# EAGLE design Teensy3_2_rev2 (EAGLE 9.5.1)

## Sheet 1 of 2: IO Conditioning
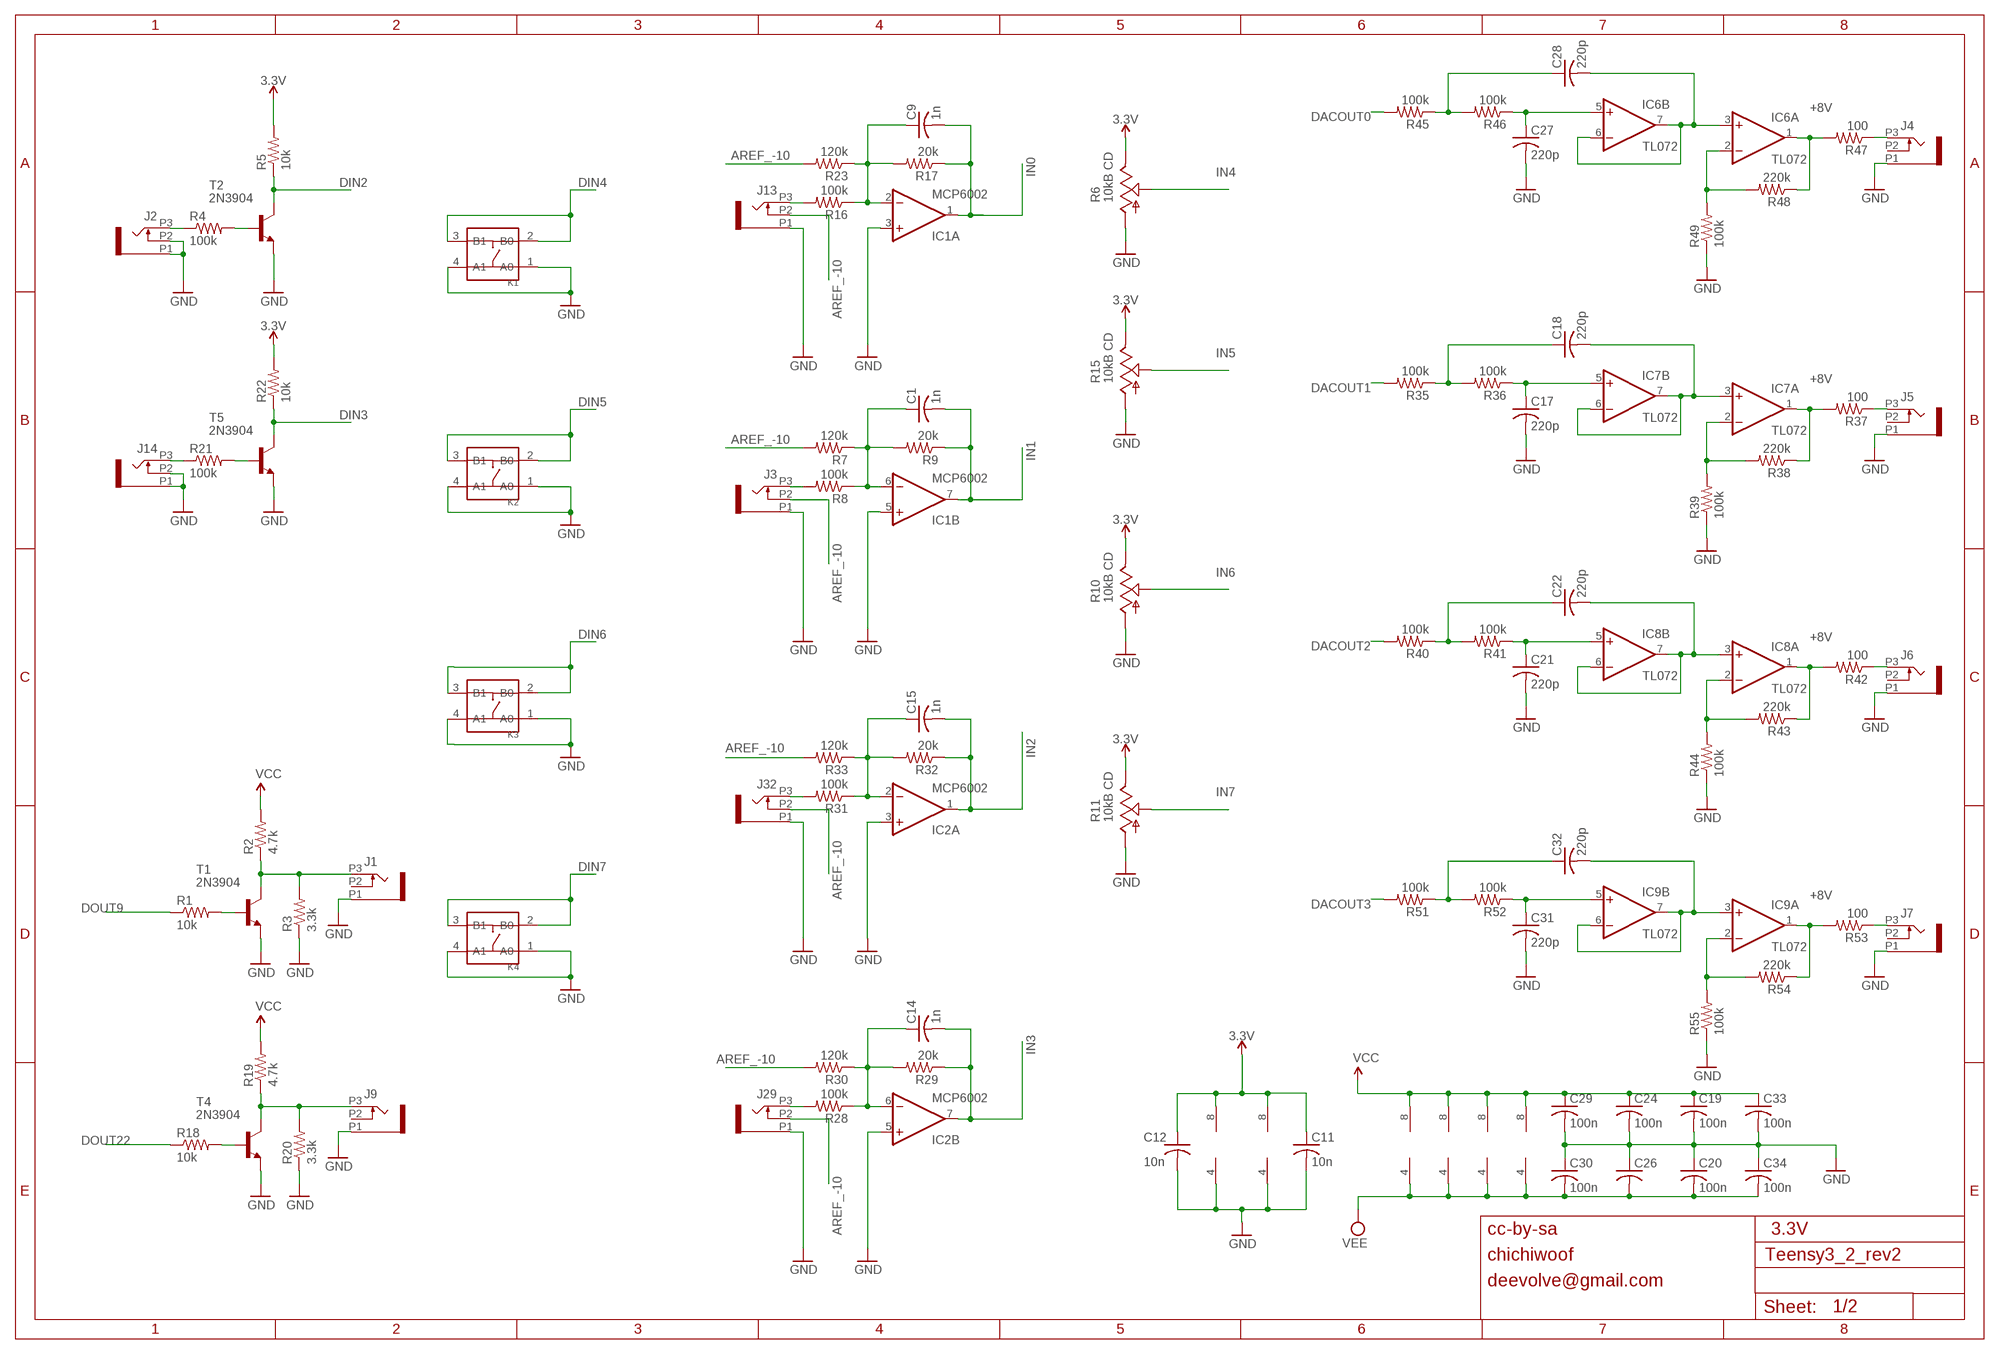
[diagram p0: schematic, sheet 1]

### Parts
C1  1n  C-US050-025X075  [C050-025X075]
C9  1n  C-US050-025X075  [C050-025X075]
C11  10n  C-US050-025X075  [C050-025X075]
C12  10n  C-US050-025X075  [C050-025X075]
C14  1n  C-US050-025X075  [C050-025X075]
C15  1n  C-US050-025X075  [C050-025X075]
C17  220p  C-US050-025X075  [C050-025X075]
C18  220p  C-US050-025X075  [C050-025X075]
C19  100n  C-US050-025X075  [C050-025X075]
C20  100n  C-US050-025X075  [C050-025X075]
C21  220p  C-US050-025X075  [C050-025X075]
C22  220p  C-US050-025X075  [C050-025X075]
C24  100n  C-US050-025X075  [C050-025X075]
C26  100n  C-US050-025X075  [C050-025X075]
C27  220p  C-US050-025X075  [C050-025X075]
C28  220p  C-US050-025X075  [C050-025X075]
C29  100n  C-US050-025X075  [C050-025X075]
C30  100n  C-US050-025X075  [C050-025X075]
C31  220p  C-US050-025X075  [C050-025X075]
C32  220p  C-US050-025X075  [C050-025X075]
C33  100n  C-US050-025X075  [C050-025X075]
C34  100n  C-US050-025X075  [C050-025X075]
IC1  MCP6002  TL072D  [SO08]
IC2  MCP6002  TL072D  [SO08]
IC6  TL072  TL072D  [SO08]
IC7  TL072  TL072D  [SO08]
IC8  TL072  TL072D  [SO08]
IC9  TL072  TL072D  [SO08]
J1  PJ301_THONKICONN6  [WQP_PJ_301M6]
J2  PJ301_THONKICONN6  [WQP_PJ_301M6]
J3  PJ301_THONKICONN6  [WQP_PJ_301M6]
J4  PJ301_THONKICONN6  [WQP_PJ_301M6]
J5  PJ301_THONKICONN6  [WQP_PJ_301M6]
J6  PJ301_THONKICONN6  [WQP_PJ_301M6]
J7  PJ301_THONKICONN6  [WQP_PJ_301M6]
J9  PJ301_THONKICONN6  [WQP_PJ_301M6]
J13  PJ301_THONKICONN6  [WQP_PJ_301M6]
J14  PJ301_THONKICONN6  [WQP_PJ_301M6]
J29  PJ301_THONKICONN6  [WQP_PJ_301M6]
J32  PJ301_THONKICONN6  [WQP_PJ_301M6]
K1  DIP-SWITCH-TACTILE-SPST-NO/TS-1109(4P-D6.0MM)'TS-1109'  [SW4-6.0X6.0X5.0MM]
K2  DIP-SWITCH-TACTILE-SPST-NO/TS-1109(4P-D6.0MM)'TS-1109'  [SW4-6.0X6.0X5.0MM]
K3  DIP-SWITCH-TACTILE-SPST-NO/TS-1109(4P-D6.0MM)'TS-1109'  [SW4-6.0X6.0X5.0MM]
K4  DIP-SWITCH-TACTILE-SPST-NO/TS-1109(4P-D6.0MM)'TS-1109'  [SW4-6.0X6.0X5.0MM]
R1  10k  R-US_0204/7  [0204/7]
R2  4.7k  R-US_0204/7  [0204/7]
R3  3.3k  R-US_0204/7  [0204/7]
R4  100k  R-US_0204/7  [0204/7]
R5  10k  R-US_0204/7  [0204/7]
R6  10kB CD  POT_USVERTICAL_PS  [ALPS_POT_VERTICAL_PS]
R7  120k  R-US_0204/7  [0204/7]
R8  100k  R-US_0204/7  [0204/7]
R9  20k  R-US_0204/7  [0204/7]
R10  10kB CD  POT_USVERTICAL_PS  [ALPS_POT_VERTICAL_PS]
R11  10kB CD  POT_USVERTICAL_PS  [ALPS_POT_VERTICAL_PS]
R15  10kB CD  POT_USVERTICAL_PS  [ALPS_POT_VERTICAL_PS]
R16  100k  R-US_0204/7  [0204/7]
R17  20k  R-US_0204/7  [0204/7]
R18  10k  R-US_0204/7  [0204/7]
R19  4.7k  R-US_0204/7  [0204/7]
R20  3.3k  R-US_0204/7  [0204/7]
R21  100k  R-US_0204/7  [0204/7]
R22  10k  R-US_0204/7  [0204/7]
R23  120k  R-US_0204/7  [0204/7]
R28  100k  R-US_0204/7  [0204/7]
R29  20k  R-US_0204/7  [0204/7]
R30  120k  R-US_0204/7  [0204/7]
R31  100k  R-US_0204/7  [0204/7]
R32  20k  R-US_0204/7  [0204/7]
R33  120k  R-US_0204/7  [0204/7]
R35  100k  R-US_0204/7  [0204/7]
R36  100k  R-US_0204/7  [0204/7]
R37  100  R-US_0204/7  [0204/7]
R38  220k  R-US_0204/7  [0204/7]
R39  100k  R-US_0204/7  [0204/7]
R40  100k  R-US_0204/7  [0204/7]
R41  100k  R-US_0204/7  [0204/7]
R42  100  R-US_0204/7  [0204/7]
R43  220k  R-US_0204/7  [0204/7]
R44  100k  R-US_0204/7  [0204/7]
R45  100k  R-US_0204/7  [0204/7]
R46  100k  R-US_0204/7  [0204/7]
R47  100  R-US_0204/7  [0204/7]
R48  220k  R-US_0204/7  [0204/7]
R49  100k  R-US_0204/7  [0204/7]
R51  100k  R-US_0204/7  [0204/7]
R52  100k  R-US_0204/7  [0204/7]
R53  100  R-US_0204/7  [0204/7]
R54  220k  R-US_0204/7  [0204/7]
R55  100k  R-US_0204/7  [0204/7]
T1  2N3904  [TO92]
T2  2N3904  [TO92]
T4  2N3904  [TO92]
T5  2N3904  [TO92]

### Nets
3.3V [+3V3]: C11.1 C12.1 IC1.8(P:V+) IC2.8(P:V+) R5.2 R6.P$1(E) R10.P$1(E) R11.P$1(E) R15.P$1(E) R22.2 ; also sheet 2
AREF_-10 [-10V]: J3.P2 J13.P2 J29.P2 J32.P2 R7.2 R23.2 R30.2 R33.2 ; also sheet 2
DACOUT0: R45.2 ; also sheet 2
DACOUT1: R35.2 ; also sheet 2
DACOUT2: R40.2 ; also sheet 2
DACOUT3: R51.2 ; also sheet 2
DIN2: R5.1 T2.1(C) ; also sheet 2
DIN3: R22.1 T5.1(C) ; also sheet 2
DIN4: K1.2(B0) K1.3(B1) ; also sheet 2
DIN5: K2.2(B0) K2.3(B1) ; also sheet 2
DIN6: K3.2(B0) K3.3(B1) ; also sheet 2
DIN7: K4.2(B0) K4.3(B1) ; also sheet 2
DOUT9: R1.1 ; also sheet 2
DOUT22: R18.1 ; also sheet 2
GND [GND]: C11.2 C12.2 C17.2 C19.2 C20.1 C21.2 C24.2 C26.1 C27.2 C29.2 C30.1 C31.2 C33.2 C34.1 IC1.3(A:+IN) IC1.4(P:V-) IC1.5(B:+IN) IC2.3(A:+IN) IC2.4(P:V-) IC2.5(B:+IN) J1.P1 J2.P1 J2.P2 J3.P1 J4.P1 J5.P1 J6.P1 J7.P1 J9.P1 J13.P1 J14.P1 J14.P2 J29.P1 J32.P1 K1.1(A0) K1.4(A1) K2.1(A0) K2.4(A1) K3.1(A0) K3.4(A1) K4.1(A0) K4.4(A1) R3.1 R6.P$3(A) R10.P$3(A) R11.P$3(A) R15.P$3(A) R20.1 R39.1 R44.1 R49.1 R55.1 T1.3(E) T2.3(E) T4.3(E) T5.3(E) ; also sheet 2
IN0: C9.2 IC1.1(A:OUT) R17.1 ; also sheet 2
IN1: C1.2 IC1.7(B:OUT) R9.1 ; also sheet 2
IN2: C15.2 IC2.1(A:OUT) R32.1 ; also sheet 2
IN3: C14.2 IC2.7(B:OUT) R29.1 ; also sheet 2
IN4: R6.P$2(S) ; also sheet 2
IN5: R15.P$2(S) ; also sheet 2
IN6: R10.P$2(S) ; also sheet 2
IN7: R11.P$2(S) ; also sheet 2
N$1: R1.2 T1.2(B)
N$2: J1.P3 R2.1 R3.2 T1.1(C)
N$5: J3.P3 R8.2
N$6: J13.P3 R16.2
N$9: C1.1 IC1.6(B:-IN) R7.1 R8.1 R9.2
N$11: C9.1 IC1.2(A:-IN) R16.1 R17.2 R23.1
N$12: R18.2 T4.2(B)
N$13: J9.P3 R19.1 R20.2 T4.1(C)
N$16: J14.P3 R21.1
N$17: R21.2 T5.2(B)
N$22: J4.P3 R47.1
N$28: C28.2 IC6.3(A:+IN) IC6.6(B:-IN) IC6.7(B:OUT)
N$29: C27.1 IC6.5(B:+IN) R46.1
N$30: C28.1 R45.1 R46.2
N$31: J29.P3 R28.2
N$32: C14.1 IC2.6(B:-IN) R28.1 R29.2 R30.1
N$34: J32.P3 R31.2
N$35: C15.1 IC2.2(A:-IN) R31.1 R32.2 R33.1
N$38: C18.2 IC7.3(A:+IN) IC7.6(B:-IN) IC7.7(B:OUT)
N$39: C17.1 IC7.5(B:+IN) R36.1
N$40: C18.1 R35.1 R36.2
N$41: IC7.2(A:-IN) R38.2 R39.2
N$42: IC7.1(A:OUT) R37.2 R38.1
N$43: IC6.2(A:-IN) R48.2 R49.2
N$44: IC6.1(A:OUT) R47.2 R48.1
N$49: C22.2 IC8.3(A:+IN) IC8.6(B:-IN) IC8.7(B:OUT)
N$50: C21.1 IC8.5(B:+IN) R41.1
N$51: C22.1 R40.1 R41.2
N$52: IC8.2(A:-IN) R43.2 R44.2
N$53: IC8.1(A:OUT) R42.2 R43.1
N$54: C32.2 IC9.3(A:+IN) IC9.6(B:-IN) IC9.7(B:OUT)
N$55: C31.1 IC9.5(B:+IN) R52.1
N$57: J2.P3 R4.1
N$58: C32.1 R51.1 R52.2
N$59: IC9.2(A:-IN) R54.2 R55.2
N$60: IC9.1(A:OUT) R53.2 R54.1
N$66: R4.2 T2.2(B)
UNI_OUT1: J6.P3 R42.1
UNI_OUT2: J7.P3 R53.1
UNI_OUT3: J5.P3 R37.1
VCC [VCC]: C19.1 C24.1 C29.1 C33.1 IC6.8(P:V+) IC7.8(P:V+) IC8.8(P:V+) IC9.8(P:V+) R2.2 R19.2 ; also sheet 2
VEE [VEE]: C20.2 C26.2 C30.2 C34.2 IC6.4(P:V-) IC7.4(P:V-) IC8.4(P:V-) IC9.4(P:V-) ; also sheet 2
Unconnected: J1.P2 J4.P2 J5.P2 J6.P2 J7.P2 J9.P2

### Notes on the sheet
- +8V
- +8V
- +8V
- +8V
- cc-by-sa | 3.3V
- chichiwoof
- deevolve@gmail.com

## Sheet 2 of 2: Power and Arduino Pins
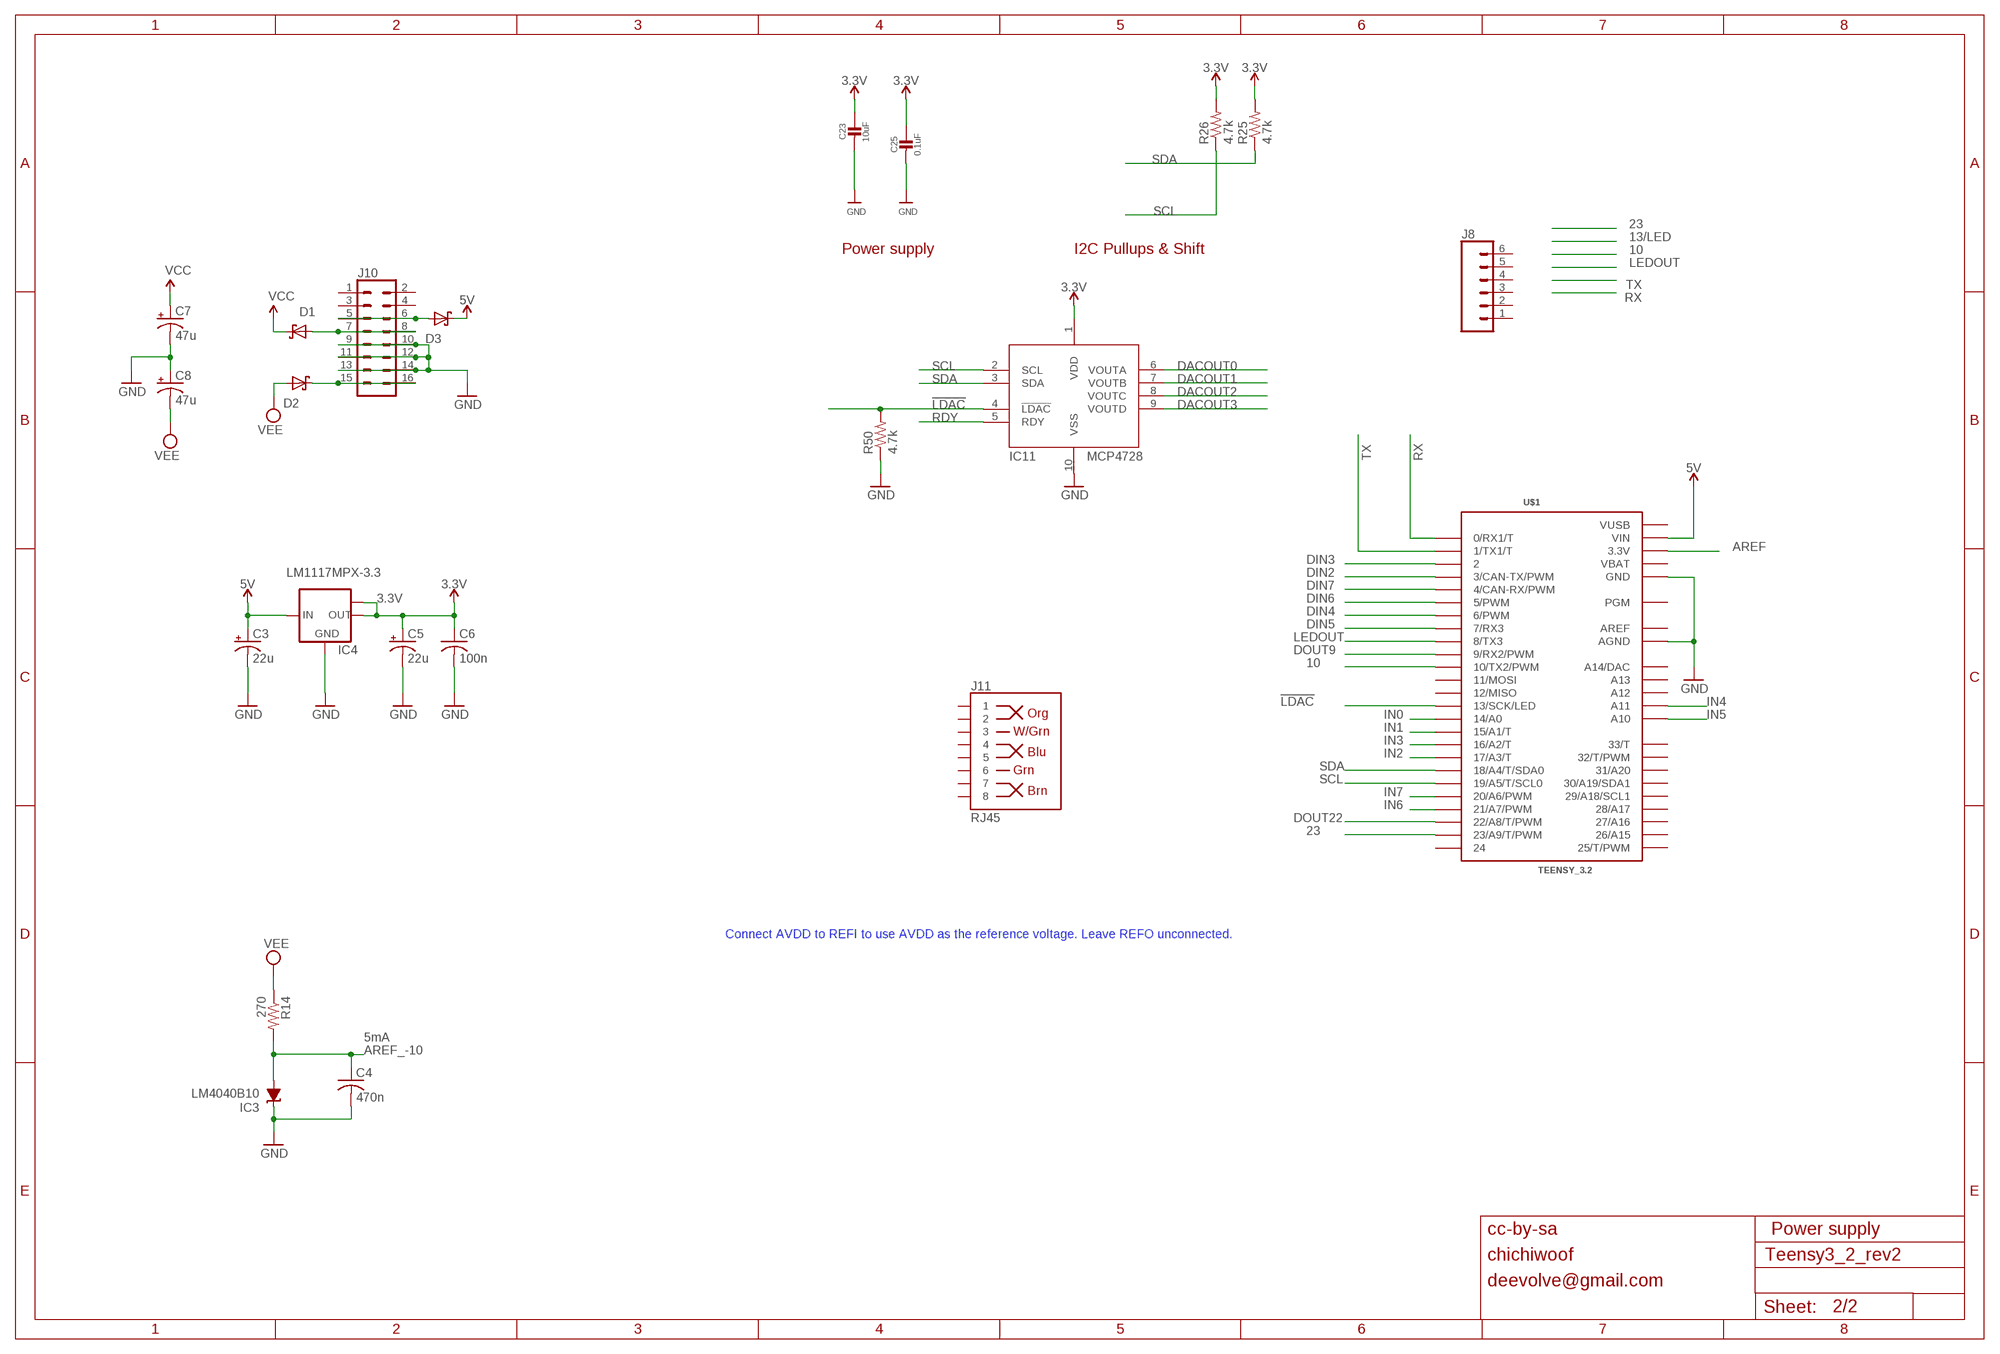
[diagram p1: schematic, sheet 2]

### Parts
C3  22u  CPOL-USE2.5-7  [E2,5-7]
C4  470n  C-US050-025X075  [C050-025X075]
C5  22u  CPOL-USE2.5-7  [E2,5-7]
C6  100n  C-US050-025X075  [C050-025X075]
C7  47u  CPOL-USE2.5-7  [E2,5-7]
C8  47u  CPOL-USE2.5-7  [E2,5-7]
C23  10uF  CAP_CERAMIC0805-NOOUTLINE  [0805-NO]
C25  0.1uF  CAP_CERAMIC0603_NO  [0603-NO]
D1  1N5819  SCHOTTKY-DIODEDO41  [DO41-10]
D2  1N5819  SCHOTTKY-DIODEDO41  [DO41-10]
D3  1N5819  SCHOTTKY-DIODEDO41  [DO41-10]
IC3  LM4040B10  LM4041B12DBZ  [DBZ_R-PDSO-G3]
IC4  LM1117MPX-3.3  [SOT223]
IC11  MCP4728  [MSOP10]
J8  CONN_06SILK_FEMALE_PTH  [1X06]
J10  CONN_08X2  [2X8]
J11  RJ45  RJ45-8  [RJ45-8]
R14  270  R-US_0204/7  [0204/7]
R25  4.7k  R-US_0204/7  [0204/7]
R26  4.7k  R-US_0204/7  [0204/7]
R50  4.7k  R-US_0204/7  [0204/7]
U$1  TEENSY_3.2  TEENSY_3.1-3.2_ALL_PINS&PADS  [TEENSY_3.0-3.2_ALL_PINS_&_PADS]

### Nets
3.3V [+3V3]: C5.+ C6.1 C23.1 C25.1 IC4.2(OUT) IC4.TAB(OUT1) IC11.1(VDD) R25.2 R26.2 ; also sheet 1
5V: C3.+ D3.C IC4.3(IN) U$1.VIN
10: U$1.10(10/TX2/PWM)
23: U$1.23/A9(23/A9/T/PWM)
!LDAC: IC11.4(!LDAC) R50.2 U$1.13(13/SCK/LED)
+12 [VCC]: D1.A J10.7 J10.8
-12 [VEE]: D2.C J10.15 J10.16
AREF: U$1.3.3V U$1.3.3V1(3.3V) U$1.3.3V2(3.3V)
AREF_-10 [-10V]: C4.1 IC3.2(A) R14.2 ; also sheet 1
DACOUT0: IC11.6(VOUTA) ; also sheet 1
DACOUT1: IC11.7(VOUTB) ; also sheet 1
DACOUT2: IC11.8(VOUTC) ; also sheet 1
DACOUT3: IC11.9(VOUTD) ; also sheet 1
DIN2: U$1.3(3/CAN-TX/PWM) ; also sheet 1
DIN3: U$1.2 ; also sheet 1
DIN4: U$1.6(6/PWM) ; also sheet 1
DIN5: U$1.7(7/RX3) ; also sheet 1
DIN6: U$1.5(5/PWM) ; also sheet 1
DIN7: U$1.4(4/CAN-RX/PWM) ; also sheet 1
DOUT9: U$1.9(9/RX2/PWM) ; also sheet 1
DOUT22: U$1.22/A8(22/A8/T/PWM) ; also sheet 1
GND [GND]: C3.- C4.2 C5.- C6.2 C7.- C8.+ C23.2 C25.2 IC3.1(C) IC4.1(GND) IC11.10(VSS) J10.9 J10.10 J10.11 J10.12 J10.13 J10.14 R50.1 U$1.AGND U$1.GND U$1.GND1(GND) U$1.GND2(GND) ; also sheet 1
IN0: U$1.14/A0 ; also sheet 1
IN1: U$1.15/A1(15/A1/T) ; also sheet 1
IN2: U$1.17/A3(17/A3/T) ; also sheet 1
IN3: U$1.16/A2(16/A2/T) ; also sheet 1
IN4: U$1.A11 ; also sheet 1
IN5: U$1.A10 ; also sheet 1
IN6: U$1.21/A7(21/A7/PWM) ; also sheet 1
IN7: U$1.20/A6(20/A6/PWM) ; also sheet 1
LEDOUT: U$1.8(8/TX3)
N$3: D3.A J10.5 J10.6
RDY: IC11.5(RDY)
RX: U$1.0(0/RX1/T)
SCL: IC11.2(SCL) R26.1 U$1.19/A5(19/A5/T/SCL0)
SDA: IC11.3(SDA) R25.1 U$1.18/A4(18/A4/T/SDA0)
TX: U$1.1(1/TX1/T)
VCC [VCC]: C7.+ D1.C ; also sheet 1
VEE [VEE]: C8.- D2.A R14.1 ; also sheet 1
Unconnected: J8.1 J8.2 J8.3 J8.4 J8.5 J8.6 J10.1 J10.2 J10.3 J10.4 J11.1 J11.2 J11.3 J11.4 J11.5 J11.6 J11.7 J11.8 U$1.11(11/MOSI) U$1.12(12/MISO) U$1.24 U$1.25(25/T/PWM) U$1.26(26/A15) U$1.27(27/A16) U$1.28(28/A17) U$1.29(29/A18/SCL1) U$1.30(30/A19/SDA1) U$1.31(31/A20) U$1.32(32/T/PWM) U$1.33(33/T) U$1.A12 U$1.A13 U$1.PGM U$1.RESET/DAC(A14/DAC)

### Notes on the sheet
- Power supply | I2C Pullups & Shift
- Connect AVDD to REFI to use AVDD as the reference voltage. Leave REFO unconnected.
- 5mA
- cc-by-sa | Power supply
- chichiwoof
- deevolve@gmail.com

## Power pins joined to a net without a drawn wire
AREF: U$1.AREF
VBAT: U$1.VBAT
VUSB: U$1.VUSB

## Library data of the parts
C1 C4 C6 C9 C11 C12 C14 C15 C17-C22 C24 C26-C34 = rcl:C-US: CAPACITOR, American symbol; SPICEPREFIX: C
C3 C5 C7 C8 = rcl:CPOL-US: POLARIZED CAPACITOR, American symbol; SPICEPREFIX: C
C23 C25 = microbuilder:CAP_CERAMIC: Ceramic Capacitors For new designs, use the packages preceded by an '_' character since they are more reliable: The following footprints should be used on most boards: _0402 - Standard footprint for regular board layouts _0603 - Standard footprint for regular board layouts _0805 - Standard footprint for regular board layouts _1206 - Standard footprint for regular board layouts For extremely tight-pitch boards where space is at a premium, the following 'micro-pitch' footprints can be used (smaller pads, no silkscreen outline, etc.): _0402MP - Micro-pitch footprint for very dense/compact boards _0603MP - Micro-pitch footprint for very dense/compact boards _0805MP - Micro-pitch footprint for very dense/compact boards _1206MP - Micro-pitch footprint for very dense/compact boards
D1-D3 = adafruit:SCHOTTKY-DIODE: Schottky Diode
IC1 IC2 IC6-IC9 = linear:TL072: OP AMP
IC3 = texas:LM4041: PRECISION MICROPOWER SHUNT VOLTAGE REFERENCE Source: http://focus.ti.com/lit/ds/slcs146e/slcs146e.pdf
IC4 = lm1117:LM1117MPX-*
IC11 = microbuilder:MCP4728
J1-J7 J9 J13 J14 J29 J32 = og-pj301_variations:PJ301_THONKICONN
J8 = SparkFun-Connectors:CONN_06: Multi connection point. Often used as Generic Header-pin footprint for 0.1 inch spaced/style header connections On any of the 0.1 inch spaced packages, you can populate with these: Break Away Headers - Straight <https://www.sparkfun.com/products/116> (PRT-00116) Break Away Male Headers - Right Angle <https://www.sparkfun.com/products/553> (PRT-00553) Female Headers <https://www.sparkfun.com/products/115> (PRT-00115) Break Away Headers - Machine Pin <https://www.sparkfun.com/products/117> (PRT-00117) Break Away Female Headers - Swiss Machine Pin <https://www.sparkfun.com/products/743> (PRT-00743) Arduino Stackable Header - 6 Pin <https://www.sparkfun.com/products/9280> (PRT-09280) For SCREWTERMINALS and SPRING TERMINALS visit here: Screw Terimnals on SparkFun.com <https://www.sparkfun.com/search/results?term=Screw+Terminals> (5mm/3.5mm/2.54mm spacing) This device is also useful as a general connection point to wire up your design to another part of your project. Our various solder wires solder well into these plated through hole pads. Hook-Up Wire - Assortment (Stranded, 22 AWG) <https://www.sparkfun.com/products/11375> (PRT-11375) Hook-Up Wire - Assortment (Solid Core, 22 AWG) <https://www.sparkfun.com/products/11367> (PRT-11367) View the entire wire category on our website here <https://www.sparkfun.com/categories/141>; PROD_ID: CONN-08437
J10 = SparkFun-Connectors:CONN_08X2: Multi connection point. Often used as Generic Header-pin footprint for 0.1 inch spaced/style header connections You can populate with any combo of single row headers, but if you'd like an exact match, check this: Header - 2x8 (Male, 0.1") <https://www.sparkfun.com/products/13156> (PRT-13156) On any of the 0.1 inch spaced packages, you can populate with these: Break Away Headers - Straight <https://www.sparkfun.com/products/116> (PRT-00116) Break Away Male Headers - Right Angle <https://www.sparkfun.com/products/553> (PRT-00553) Female Headers <https://www.sparkfun.com/products/115> (PRT-00115) Break Away Headers - Machine Pin <https://www.sparkfun.com/products/117> (PRT-00117) Break Away Female Headers - Swiss Machine Pin <https://www.sparkfun.com/products/743> (PRT-00743)
J11 = SparkFun-Connectors:RJ45-8: RJ45 Jack - 8 pin Simple RJ45, 8-pin connection. Commonly used for Cat5, Cat5e, and Cat6 Ethernet cables. Here is the connector we sell at SparkFun: RJ45 8-Pin Connector <https://www.sparkfun.com/products/643> (PRT-00643) Datasheet <https://cdn.sparkfun.com/datasheets/Prototyping/04908.pdf> It is used on this SparkFun product: SparkFun RJ45 Breakout <https://www.sparkfun.com/products/716> (BOB-00716) Note, you may also be interested in the "MAGJACK" version of this. It is basically a RJ45 connector, but also has some status LEDs built into the connector housing. You can check that out in this library at the device named "MAGJACK.dev" and see these products online: RJ45 Ethernet MagJack-Compatible <https://www.sparkfun.com/products/8534> (PRT-08534) SparkFun RJ45 MagJack Breakout <https://www.sparkfun.com/products/13021> (BOB-13021); PROD_ID: CONN-08506; SF_ID: PRT-00643
K1-K4 = OPL_Switch:DIP-SWITCH-TACTILE-SPST-NO/TS-1109(4P-D6.0MM): 311020024
R1-R5 R7-R9 R14 R16-R23 R25 R26 R28-R33 R35-R55 = rcl:R-US_: RESISTOR, American symbol; SPICEPREFIX: R
R6 R10 R11 R15 = pot-alps:POT_US
T1 T2 T4 T5 = transistor:2N3904: NPN TRANSISTOR
U$1 = Teensy_3_and_LC_Series_Boards_v1.4:TEENSY_3.1-3.2_ALL_PINS&PADS: Footprint for Teensy 3.1 or 3.2 board using all pads and all through-holes. Pads need a 2x7 0.1" SMD header.

## Net classes
0 default: width 0.254 mm, clearance 0.203 mm
1 GND: width 0.406 mm, clearance 0.254 mm to class 0, clearance 0.254 mm
2 +3V3: width 0.356 mm, clearance 0.152 mm to class 0, clearance 0.254 mm
3 -10V: width 0.356 mm, clearance 0.152 mm to class 0, clearance 0.254 mm
4 VCC: width 0.457 mm, clearance 0.152 mm to class 0, clearance 0.254 mm
5 VEE: width 0.457 mm, clearance 0.152 mm to class 0, clearance 0.254 mm

## Board
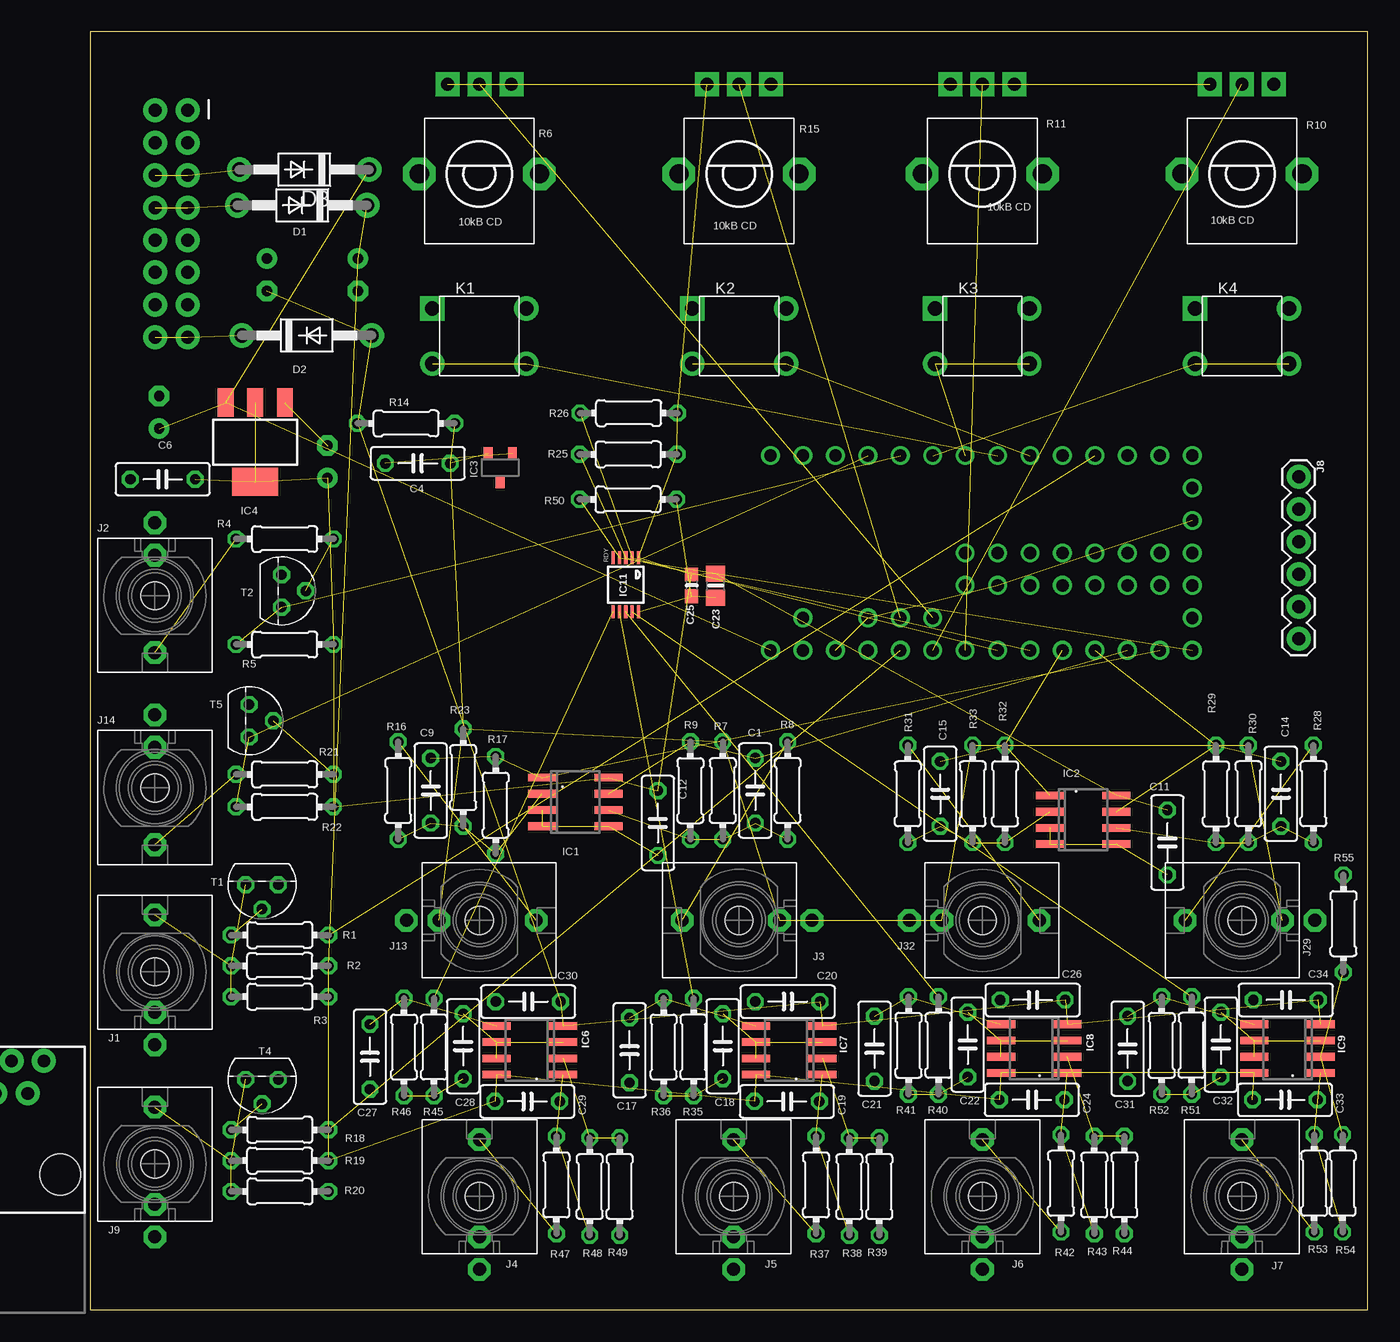
[diagram p2: board, top side]
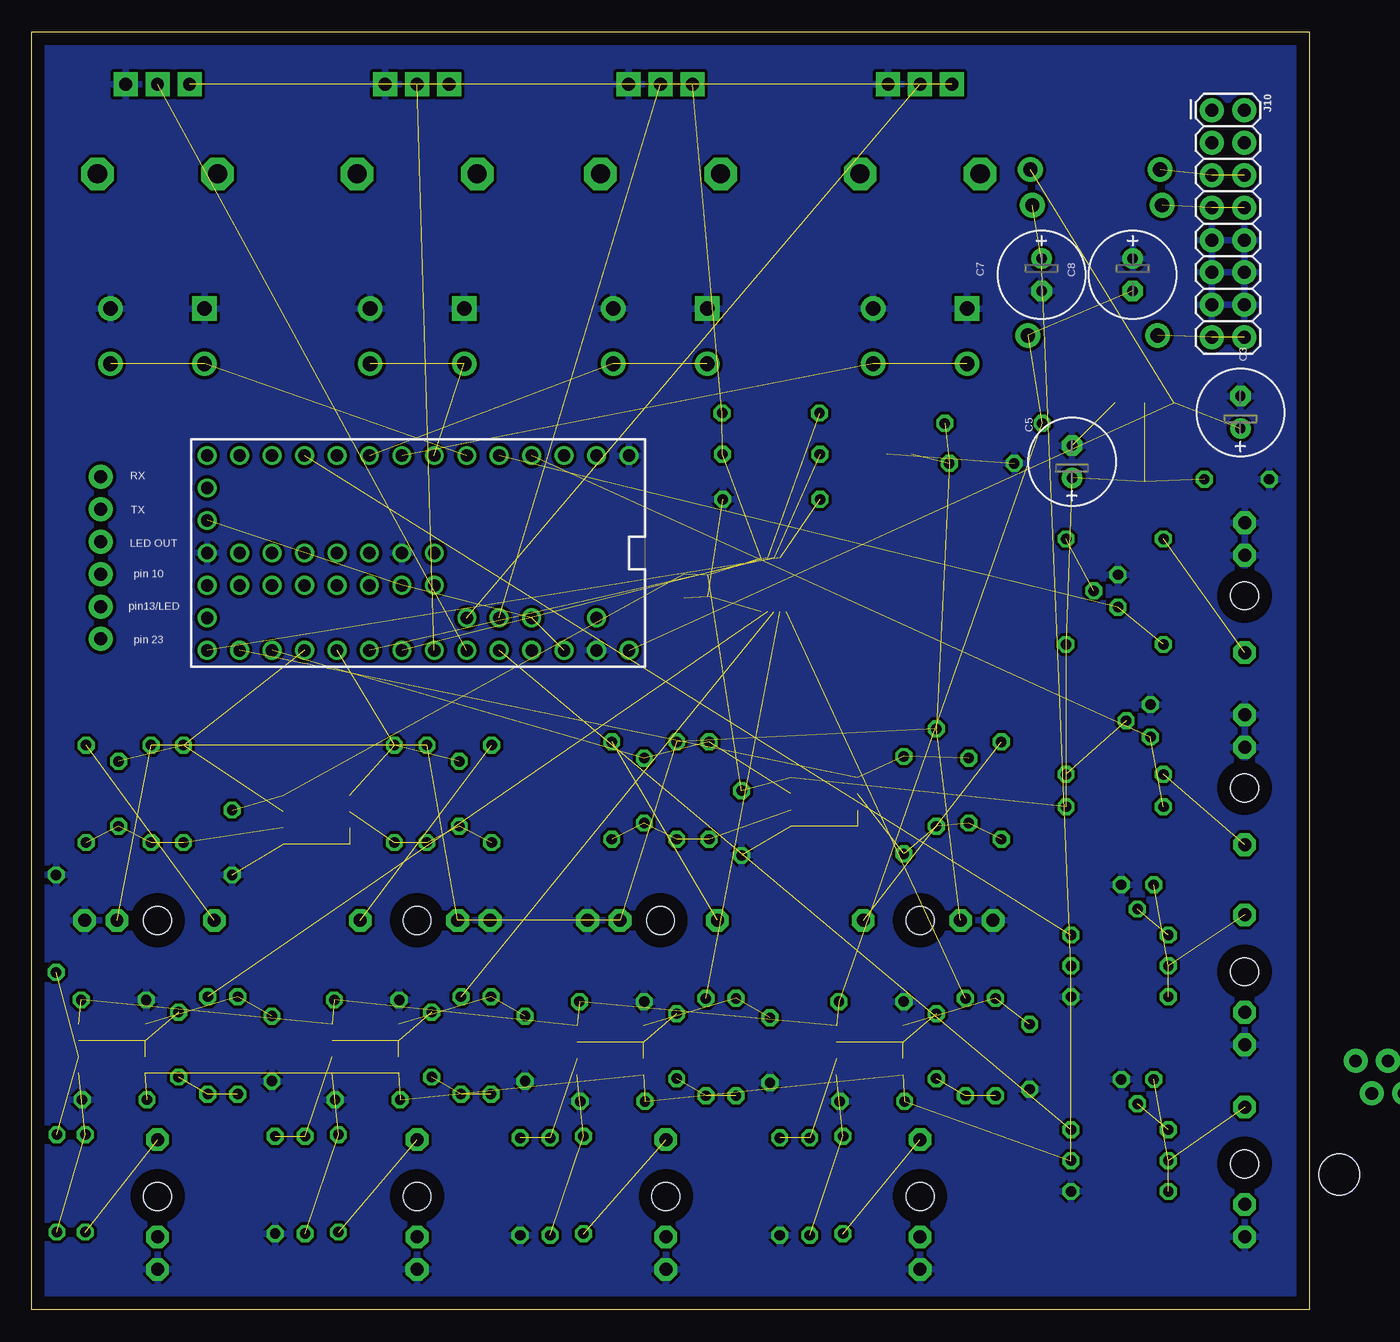
[diagram p3: board, bottom side, seen from below]

Size 100 x 100 mm. Coordinates in mm from the lower left corner, seen from the top.
Outline: 0,0 100,0 100,100 0,100 0,0
Copper layers (1*16): Top 0.035mm / dielectric 1.5mm / Bottom 0.035mm
Design rules "default": minimum track width 6mil, minimum drill 0.35mm, track to track 6mil, track to pad 6mil, pad to pad 6mil, via to via 6mil, smd to smd 6mil, copper to edge 40mil, drill to drill 6mil, minimum pad ring 10mil, minimum via ring 8mil, stop-mask expansion 4mil, vias tented up to drill 0mil, thermal gap 10mil

### Footprints (pad centres in the part's own frame; a part is rotated, then mirrored left to right if it is on the bottom)
C050-025X075 = drill 0.813 octagon: 1 -2.54,0; 2 2.54,0
E2,5-7 = drill 0.813 pad 1.6: + -1.27,0 | drill 0.813 pad 1.6 octagon: - 1.27,0
0805-NO = smd 1.24 x 1.5: 1 -0.95,0; 2 0.95,0
0603-NO = smd 1.075 x 1: 1 -0.85,0; 2 0.85,0
DO41-10 = drill 1.118 pad 1.93: A 5.08,0; C -5.08,0
SO08 = smd 0.6 x 2.2: 1 -1.905,-2.6; 2 -0.635,-2.6; 3 0.635,-2.6; 4 1.905,-2.6; 5 1.905,2.6; 6 0.635,2.6; 7 -0.635,2.6; 8 -1.905,2.6
DBZ_R-PDSO-G3 = smd 0.7 x 1: 1 -0.95,-1.1; 2 0.95,-1.1; 3 0,1.1
SOT223 = smd 1.219 x 2.235: 1 -2.311,-3.099; 2 0,-3.099; 3 2.311,-3.099 | smd 3.6 x 2.2: TAB 0,3.099
MSOP10 = smd 0.25 x 1: 1 -1,-2.113; 2 -0.5,-2.113; 3 0,-2.113; 4 0.5,-2.113; 5 1,-2.113; 6 1,2.113; 7 0.5,2.113; 8 0,2.113; 9 -0.5,2.113; 10 -1,2.113
WQP_PJ_301M6 = drill 1.016 pad 1.778 octagon: P1 0,-5.715; P2 0,-3.175; P3 0,4.445 | hole 2.2: 0,0
1X06 = drill 1.016 pad 1.88: 1 0,0; 2 2.54,0; 3 5.08,0; 4 7.62,0; 5 10.16,0; 6 12.7,0
2X8 = drill 1.016 pad 1.88: 1 0,0; 2 0,2.54; 3 2.54,0; 4 2.54,2.54; 5 5.08,0; 6 5.08,2.54; 7 7.62,0; 8 7.62,2.54; 9 10.16,0; 10 10.16,2.54; 11 12.7,0; 12 12.7,2.54; 13 15.24,0; 14 15.24,2.54; 15 17.78,0; 16 17.78,2.54
RJ45-8 = drill 1 pad 1.88 square: 1 -4.445,6.35 | drill 1 pad 1.88: 2 -3.175,8.89; 3 -1.905,6.35; 4 -0.635,8.89; 5 0.635,6.35; 6 1.905,8.89; 7 3.175,6.35; 8 4.445,8.89 | hole 3.2: -5.715,0; 5.715,0
SW4-6.0X6.0X5.0MM = drill 1.143 pad 1.905 square: 1 -3.683,2.159 | drill 1.143 pad 1.905: 2 -3.683,-2.159; 3 3.683,-2.159; 4 3.683,2.159
0204/7 = drill 0.813 octagon: 1 -3.81,0; 2 3.81,0
ALPS_POT_VERTICAL_PS = drill 1 pad 1.88 square: P$1 -2.5,7; P$2 0,7; P$3 2.5,7 | drill 1.5 pad 2.54 octagon: P$4 -4.7,0; P$5 4.7,0
TO92 = drill 0.813 octagon: 1 1.27,0; 2 0,1.905; 3 -1.27,0
TEENSY_3.0-3.2_ALL_PINS_&_PADS = drill 0.965: 0 -7.62,13.97; 1 -7.62,11.43; 2 -7.62,8.89; 3 -7.62,6.35; 3.3V 7.62,11.43; 3.3V1 -2.54,-16.51; 3.3V2 2.54,-1.27; 4 -7.62,3.81; 5 -7.62,1.27; 6 -7.62,-1.27; 7 -7.62,-3.81; 8 -7.62,-6.35; 9 -7.62,-8.89; 10 -7.62,-11.43; 11 -7.62,-13.97; 12 -7.62,-16.51; 13 7.62,-16.51; 14/A0 7.62,-13.97; 15/A1 7.62,-11.43; 16/A2 7.62,-8.89; 17/A3 7.62,-6.35; 18/A4 7.62,-3.81; 19/A5 7.62,-1.27; 20/A6 7.62,1.27; 21/A7 7.62,3.81; 22/A8 7.62,6.35; 23/A9 7.62,8.89; 24 0,-3.81; 25 0,-6.35; 26 0,-8.89; 27 0,-11.43; 28 0,-13.97; 29 2.54,-13.97; 30 2.54,-11.43; 31 2.54,-8.89; 32 2.54,-6.35; 33 2.54,-3.81; A10 5.08,6.35; A11 5.08,3.81; A12 0,1.27; A13 2.54,1.27; AGND 7.62,13.97; AREF 5.08,8.89; GND -7.62,16.51; GND1 0,-16.51; GND2 0,-1.27; PGM 2.54,-16.51; RESET/DAC 5.08,-16.51; VBAT -5.08,-16.51; VIN 7.62,16.51; VUSB 5.08,13.97

### Placement (x,y rotation side)
C1  52.07,40.64 90 top
C3  5.41,70.23 90 bottom
C4  25.65,66.24 180 top
C5  18.59,66.37 90 bottom
C6  5.69,65 180 top
C7  20.98,81 270 bottom
C8  13.84,81 270 bottom
C9  26.67,40.64 90 top
C11  84.33,36.58 270 top
C12  44.45,38.1 270 top
C14  93.22,40.39 90 top
C15  66.55,40.39 90 top
C17  42.23,20.32 270 top
C18  49.53,20.64 90 top
C19  54.55,16.32 0 top
C20  54.61,24.13 0 top
C21  61.4,20.45 270 top
C22  68.71,20.76 90 top
C23  48.97,56.67 270 top
C24  73.72,16.45 0 top
C25  47.09,56.69 270 top
C26  73.79,24.26 0 top
C27  21.91,19.81 270 top
C28  29.21,20.64 90 top
C29  34.23,16.32 0 top
C30  34.29,24.13 0 top
C31  81.22,20.45 270 top
C32  88.52,20.76 90 top
C33  93.54,16.45 0 top
C34  93.6,24.26 0 top
D1  16.61,86.44 180 top
D2  16.97,76.25 0 top
D3  16.76,89.23 180 top
IC1  37.97,39.75 270 top
IC2  77.72,38.35 270 top
IC3  32.11,65.91 180 top
IC4  12.93,67.89 180 top
IC6  34.42,20.32 90 top
IC7  54.74,20.32 90 top
IC8  73.91,20.45 90 top
IC9  93.73,20.45 90 top
IC11  41.94,56.74 180 top
J1  5.08,26.46 0 top
J2  5.08,55.88 180 top
J3  50.8,30.48 90 top
J4  30.48,8.89 0 top
J5  50.38,8.89 0 top
J6  69.85,8.89 0 top
J7  90.17,8.89 0 top
J8  94.61,65.2 270 top
J9  5.08,11.43 0 top
J10  7.65,93.88 270 bottom
J11  -8.05,10.59 0 top
J13  30.48,30.48 270 top
J14  5.08,40.85 180 top
J29  90.17,30.48 90 top
J32  69.85,30.48 270 top
K1  30.48,76.2 0 top
K2  50.83,76.2 0 top
K3  69.85,76.2 0 top
K4  90.17,76.2 0 top
R1  14.86,29.34 180 top
R2  14.86,26.92 0 top
R3  14.86,24.51 180 top
R4  15.24,60.33 0 top
R5  15.24,52.07 0 top
R6  30.48,88.9 0 top
R7  49.53,40.64 90 top
R8  54.61,40.64 90 top
R9  46.99,40.64 270 top
R10  90.17,88.9 0 top
R11  69.85,88.9 0 top
R14  24.74,69.37 0 top
R15  50.8,88.9 0 top
R16  24.13,40.64 90 top
R17  31.75,39.5 270 top
R18  14.86,14.1 180 top
R19  14.86,11.68 0 top
R20  14.86,9.27 180 top
R21  15.24,41.91 0 top
R22  15.24,39.37 0 top
R23  29.21,41.66 90 top
R25  42.14,66.95 0 top
R26  42.16,70.18 0 top
R28  95.76,40.39 90 top
R29  88.14,40.39 270 top
R30  90.68,40.39 90 top
R31  64.01,40.39 90 top
R32  71.63,40.39 270 top
R33  69.09,40.39 90 top
R35  47.24,20.57 90 top
R36  44.89,20.57 270 top
R37  56.83,9.78 90 top
R38  59.44,9.65 90 top
R39  61.79,9.65 90 top
R40  66.42,20.7 90 top
R41  64.07,20.7 270 top
R42  76.01,9.91 90 top
R43  78.61,9.78 90 top
R44  80.96,9.78 90 top
R45  26.92,20.57 90 top
R46  24.57,20.57 270 top
R47  36.51,9.78 90 top
R48  39.12,9.65 90 top
R49  41.47,9.65 90 top
R50  42.11,63.42 180 top
R51  86.23,20.7 90 top
R52  83.88,20.7 270 top
R53  95.82,9.91 90 top
R54  98.04,9.91 90 top
R55  98.11,30.23 270 top
T1  13.46,33.27 180 top
T2  14.99,56.26 270 top
T4  13.46,18.03 180 top
T5  12.45,46.1 270 top
U$1  69.77,59.23 270 bottom

### Tracks (layer width: path | path; a pad name or v marks a point on that pad's centre or on a via)
3.3V  (18 unrouted)
5V  (3 unrouted)
!LDAC  (2 unrouted)
+12  (2 unrouted)
-12  (2 unrouted)
AREF  (3 unrouted)
AREF_-10  (10 unrouted)
DACOUT0  (1 unrouted)
DACOUT1  (1 unrouted)
DACOUT2  (1 unrouted)
DACOUT3  (1 unrouted)
DIN2  (2 unrouted)
DIN3  (2 unrouted)
DIN4  (2 unrouted)
DIN5  (2 unrouted)
DIN6  (2 unrouted)
DIN7  (2 unrouted)
DOUT9  (1 unrouted)
DOUT22  (1 unrouted)
GND  (11 unrouted)
  pour Bottom: 0,100.33 100.33,100.33 101.6,99.06 101.6,0 0,0
IN0  (3 unrouted)
IN1  (3 unrouted)
IN2  (3 unrouted)
IN3  (3 unrouted)
IN4  (1 unrouted)
IN5  (1 unrouted)
IN6  (1 unrouted)
IN7  (1 unrouted)
N$1  (1 unrouted)
N$2  (3 unrouted)
N$3  (2 unrouted)
N$5  (1 unrouted)
N$6  (1 unrouted)
N$9  (4 unrouted)
N$11  (4 unrouted)
N$12  (1 unrouted)
N$13  (3 unrouted)
N$16  (1 unrouted)
N$17  (1 unrouted)
N$22  (1 unrouted)
N$28  (3 unrouted)
N$29  (2 unrouted)
N$30  (2 unrouted)
N$31  (1 unrouted)
N$32  (4 unrouted)
N$34  (1 unrouted)
N$35  (4 unrouted)
N$38  (3 unrouted)
N$39  (2 unrouted)
N$40  (2 unrouted)
N$41  (2 unrouted)
N$42  (2 unrouted)
N$43  (2 unrouted)
N$44  (2 unrouted)
N$49  (3 unrouted)
N$50  (2 unrouted)
N$51  (2 unrouted)
N$52  (2 unrouted)
N$53  (2 unrouted)
N$54  (3 unrouted)
N$55  (2 unrouted)
N$57  (1 unrouted)
N$58  (2 unrouted)
N$59  (2 unrouted)
N$60  (2 unrouted)
N$66  (1 unrouted)
SCL  (2 unrouted)
SDA  (2 unrouted)
UNI_OUT1  (1 unrouted)
UNI_OUT2  (1 unrouted)
UNI_OUT3  (1 unrouted)
VCC  (11 unrouted)
VEE  (10 unrouted)

### Text on the board
tNames: RDY | • | • | • | • | • | •
bNames: RX | TX | LED OUT | pin 10 | pin13/LED | pin 23